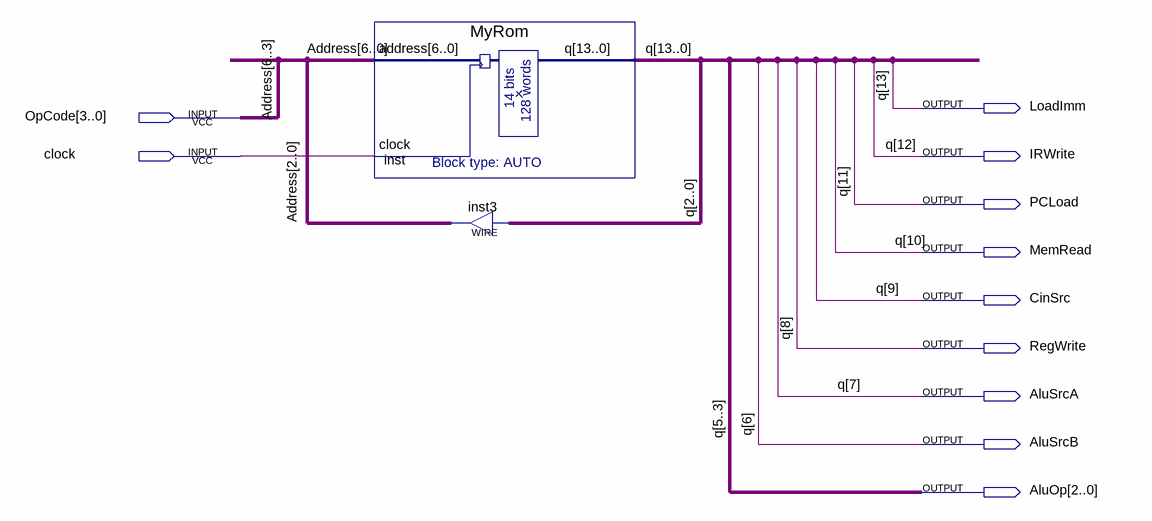
[diagram p0: schematic sheet]
// Quartus schematic CU.bdf as structural Verilog: 2 symbols, 11 pins
module CU (
  input  [3:0] OpCode,
  input  clock,
  output LoadImm,
  output IRWrite,
  output PCLoad,
  output MemRead,
  output CinSrc,
  output RegWrite,
  output AluSrcA,
  output AluSrcB,
  output [2:0] AluOp
);

  wire [2:0] Address, q;

  MyRom inst (
    .address({OpCode, Address}), .clock(clock),
    .q({LoadImm, IRWrite, PCLoad, MemRead, CinSrc, RegWrite, AluSrcA, AluSrcB, AluOp, q}));
  assign Address = q;  // WIRE inst3

  // Other names for the same wires on the sheet: Address[6:3] = OpCode;
  //   q[13:3] = {LoadImm, IRWrite, PCLoad, MemRead, CinSrc, RegWrite, AluSrcA, AluSrcB, AluOp}
endmodule
